# EAGLE schematic working (EAGLE 9.5.2)
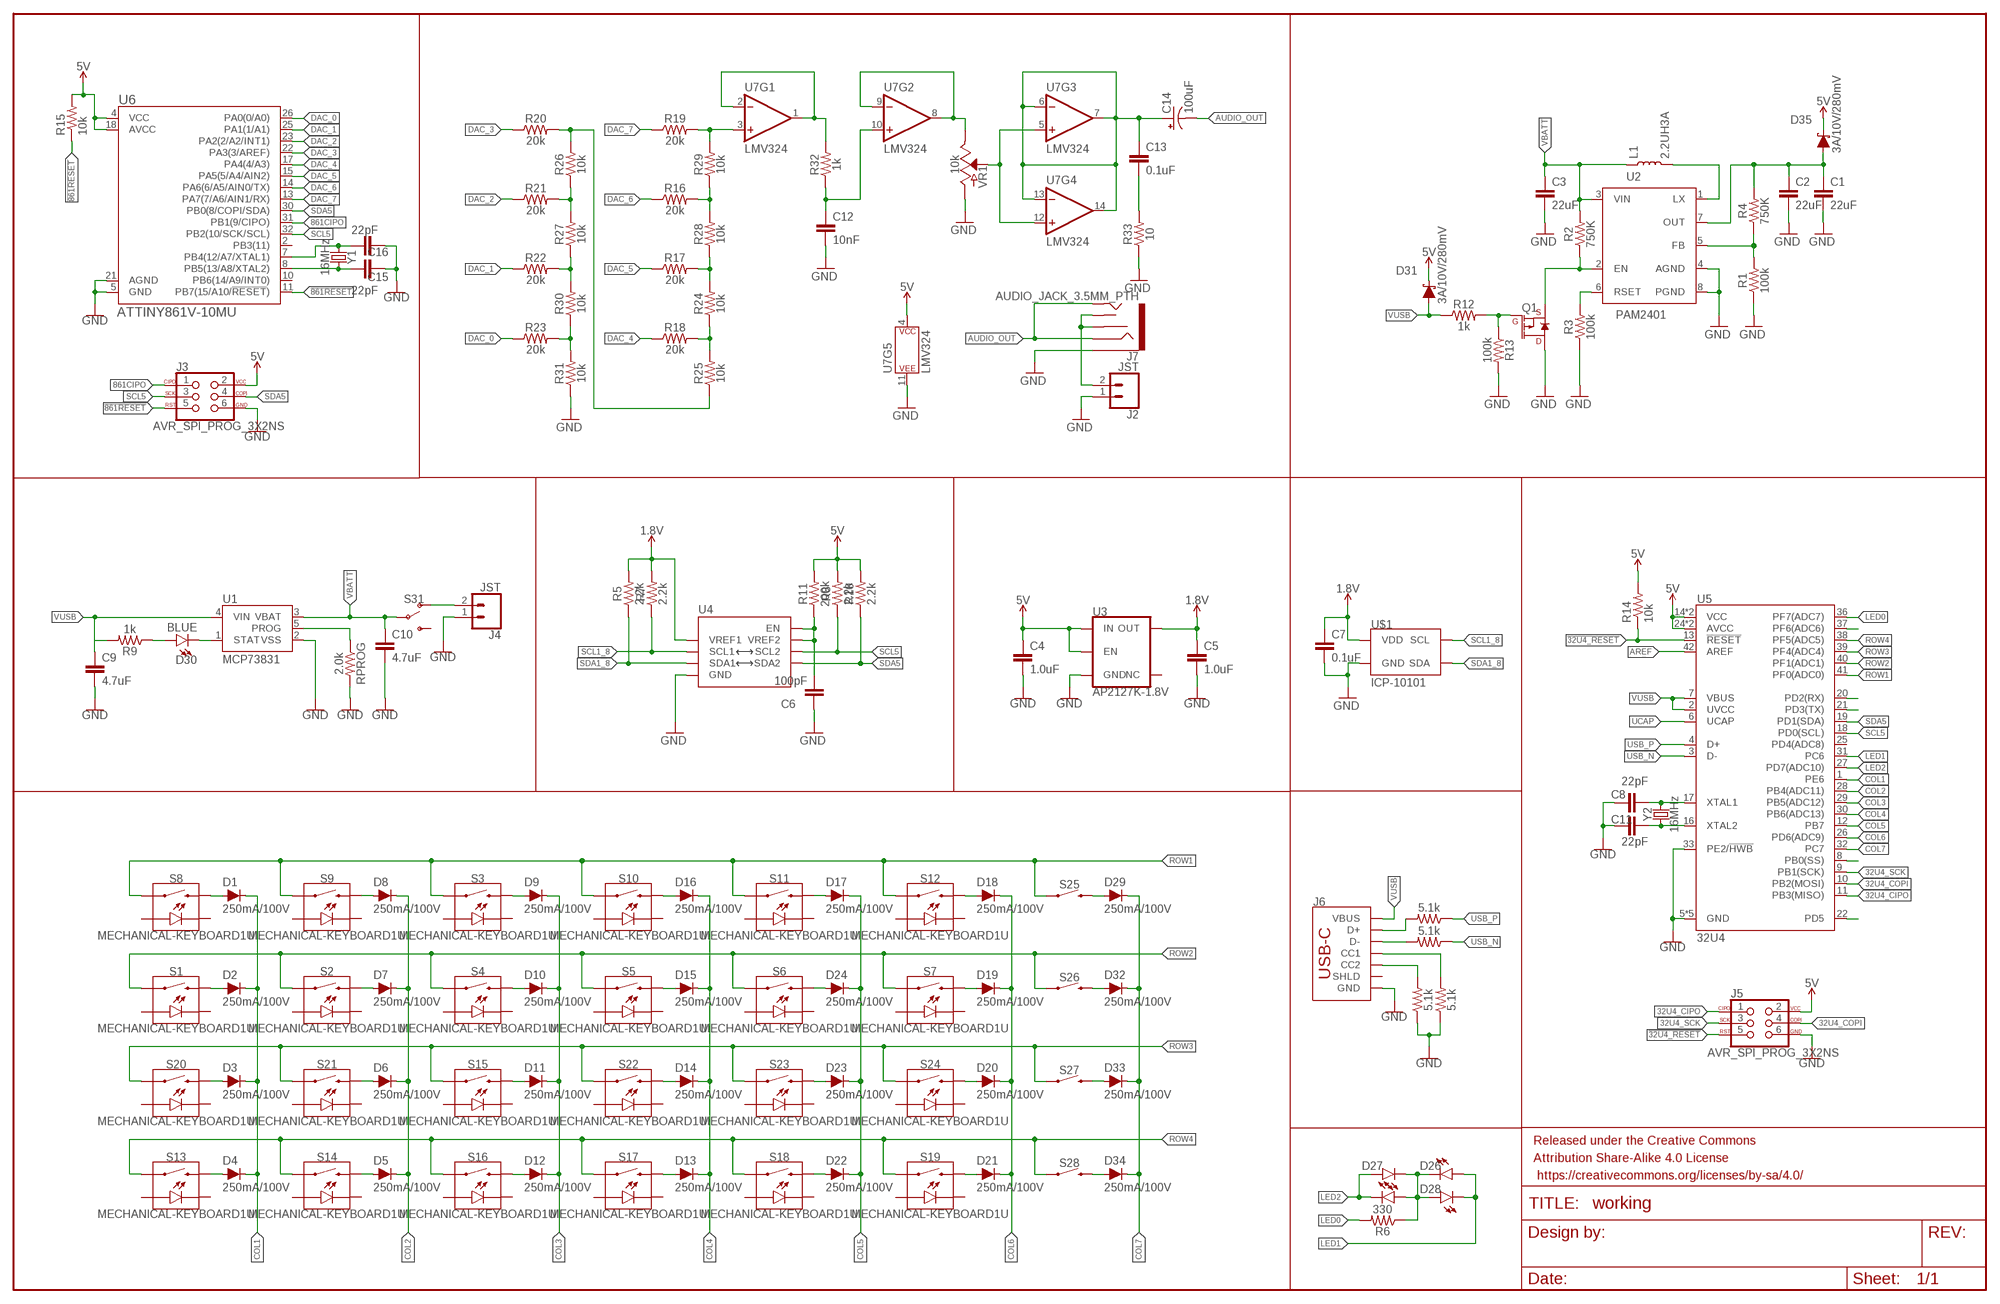
[diagram p0: schematic, sheet 1]

## Parts
C1  22uF  22UF-0805-6.3V-20%  [0805]
C2  22uF  22UF-0805-6.3V-20%  [0805]
C3  22uF  22UF-0805-6.3V-20%  [0805]
C4  1.0uF  1.0UF-0603-16V-10%  [0603]
C5  1.0uF  1.0UF-0603-16V-10%  [0603]
C6  100pF  100PF-0603-50V-5%  [0603]
C7  0.1uF  0.1UF-0603-25V-(+80/-20%)  [0603]
C8  22pF  22PF-0603-50V-5%  [0603]
C9  4.7uF  4.7UF-0603-35V-(20%)  [0603]
C10  4.7uF  4.7UF-0603-35V-(20%)  [0603]
C11  22pF  22PF-0603-50V-5%  [0603]
C12  10nF  10NF-0603-50V-10%  [0603]
C13  0.1uF  0.1UF-0603-25V-(+80/-20%)  [0603]
C14  100uF  100UF-POLAR-25V-20%(ELEC)  [PANASONIC_D]
C15  22pF  22PF-0603-50V-5%  [0603]
C16  22pF  22PF-0603-50V-5%  [0603]
D1  250mA/100V  DIODE-BAS16J  [SOD-323@1]
D2  250mA/100V  DIODE-BAS16J  [SOD-323@1]
D3  250mA/100V  DIODE-BAS16J  [SOD-323@1]
D4  250mA/100V  DIODE-BAS16J  [SOD-323@1]
D5  250mA/100V  DIODE-BAS16J  [SOD-323@1]
D6  250mA/100V  DIODE-BAS16J  [SOD-323@1]
D7  250mA/100V  DIODE-BAS16J  [SOD-323@1]
D8  250mA/100V  DIODE-BAS16J  [SOD-323@1]
D9  250mA/100V  DIODE-BAS16J  [SOD-323@1]
D10  250mA/100V  DIODE-BAS16J  [SOD-323@1]
D11  250mA/100V  DIODE-BAS16J  [SOD-323@1]
D12  250mA/100V  DIODE-BAS16J  [SOD-323@1]
D13  250mA/100V  DIODE-BAS16J  [SOD-323@1]
D14  250mA/100V  DIODE-BAS16J  [SOD-323@1]
D15  250mA/100V  DIODE-BAS16J  [SOD-323@1]
D16  250mA/100V  DIODE-BAS16J  [SOD-323@1]
D17  250mA/100V  DIODE-BAS16J  [SOD-323@1]
D18  250mA/100V  DIODE-BAS16J  [SOD-323@1]
D19  250mA/100V  DIODE-BAS16J  [SOD-323@1]
D20  250mA/100V  DIODE-BAS16J  [SOD-323@1]
D21  250mA/100V  DIODE-BAS16J  [SOD-323@1]
D22  250mA/100V  DIODE-BAS16J  [SOD-323@1]
D23  250mA/100V  DIODE-BAS16J  [SOD-323@1]
D24  250mA/100V  DIODE-BAS16J  [SOD-323@1]
D25  RED  LED-RED0603  [LED-0603@1]
D26  RED  LED-RED0603  [LED-0603@1]
D27  RED  LED-RED0603  [LED-0603@1]
D28  RED  LED-RED0603  [LED-0603@1]
D29  250mA/100V  DIODE-BAS16J  [SOD-323@1]
D30  BLUE  LED-BLUE0603  [LED-0603@1]
D31  3A/10V/280mV  DIODE-SCHOTTKY-BAT60A  [SOD-323]
D32  250mA/100V  DIODE-BAS16J  [SOD-323@1]
D33  250mA/100V  DIODE-BAS16J  [SOD-323@1]
D34  250mA/100V  DIODE-BAS16J  [SOD-323@1]
D35  3A/10V/280mV  DIODE-SCHOTTKY-BAT60A  [SOD-323]
FRAME1  FRAME-LEDGER  [CREATIVE_COMMONS]
J2  JST  CONN_02-JST-2MM-SMT  [JST-2-SMD]
J3  AVR_SPI_PROG_3X2NS  [2X3-NS]
J4  JST  CONN_02-JST-2MM-SMT  [JST-2-SMD]
J5  AVR_SPI_PROG_3X2NS  [2X3-NS]
J6  USB_C_2-LAYER_PADS  [USB-C-16P-2LAYER-PADS]
J7  AUDIO_JACK_3.5MM_PTH  [AUDIO-JACK]
L1  2.2UH3A  INDUCTOR-IFSC1515AHER2R2M01  [INDUCTOR_4X4MM]
Q1  100mA/20V/3.8Ω  MOSFET_PCH-RE1C001ZPTL  [SOT-416FL]
R1  100k  100KOHM-0603-1/10W-1%  [0603]
R2  750K  750KOHM-0603-1/10W-1%  [0603]
R3  100k  100KOHM-0603-1/10W-1%  [0603]
R4  750K  750KOHM-0603-1/10W-1%  [0603]
R5  2.2k  2.2KOHM-0603-1/10W-1%  [0603]
R6  330  330OHM-0603-1/10W-1%  [0603]
R7  2.2k  2.2KOHM-0603-1/10W-1%  [0603]
R8  2.2k  2.2KOHM-0603-1/10W-1%  [0603]
R9  1k  1KOHM-0603-1/10W-1%  [0603]
R10  2.2k  2.2KOHM-0603-1/10W-1%  [0603]
R11  200k  200KOHM-0603-1/10W-1%  [0603]
R12  1k  1KOHM-0603-1/10W-1%  [0603]
R13  100k  100KOHM-0603-1/10W-1%  [0603]
R14  10k  10KOHM-0603-1/10W-1%  [0603]
R15  10k  10KOHM-0603-1/10W-1%  [0603]
R16  20k  20KOHM-0603-1/10W-1%  [0603]
R17  20k  20KOHM-0603-1/10W-1%  [0603]
R18  20k  20KOHM-0603-1/10W-1%  [0603]
R19  20k  20KOHM-0603-1/10W-1%  [0603]
R20  20k  20KOHM-0603-1/10W-1%  [0603]
R21  20k  20KOHM-0603-1/10W-1%  [0603]
R22  20k  20KOHM-0603-1/10W-1%  [0603]
R23  20k  20KOHM-0603-1/10W-1%  [0603]
R24  10k  10KOHM-0603-1/10W-1%  [0603]
R25  10k  10KOHM-0603-1/10W-1%  [0603]
R26  10k  10KOHM-0603-1/10W-1%  [0603]
R27  10k  10KOHM-0603-1/10W-1%  [0603]
R28  10k  10KOHM-0603-1/10W-1%  [0603]
R29  10k  10KOHM-0603-1/10W-1%  [0603]
R30  10k  10KOHM-0603-1/10W-1%  [0603]
R31  10k  10KOHM-0603-1/10W-1%  [0603]
R32  1k  1KOHM-0603-1/10W-1%  [0603]
R33  10  10OHM-0603-1/10W-1%  [0603]
R34  5.1k  5.1KOHM5.1KOHM-0603-1/10W-1%  [0603]
R35  5.1k  5.1KOHM5.1KOHM-0603-1/10W-1%  [0603]
R36  5.1k  5.1KOHM5.1KOHM-0603-1/10W-1%  [0603]
R37  5.1k  5.1KOHM5.1KOHM-0603-1/10W-1%  [0603]
RPROG  2.0k  2.0KOHM-0603-1/10W-5%  [0603]
S1  MECHANICAL-KEYBOARD1U  [CHERRY-MX-LED-1U]
S2  MECHANICAL-KEYBOARD1U  [CHERRY-MX-LED-1U]
S3  MECHANICAL-KEYBOARD1U  [CHERRY-MX-LED-1U]
S4  MECHANICAL-KEYBOARD1U  [CHERRY-MX-LED-1U]
S5  MECHANICAL-KEYBOARD1U  [CHERRY-MX-LED-1U]
S6  MECHANICAL-KEYBOARD1U  [CHERRY-MX-LED-1U]
S7  MECHANICAL-KEYBOARD1U  [CHERRY-MX-LED-1U]
S8  MECHANICAL-KEYBOARD1U  [CHERRY-MX-LED-1U]
S9  MECHANICAL-KEYBOARD1U  [CHERRY-MX-LED-1U]
S10  MECHANICAL-KEYBOARD1U  [CHERRY-MX-LED-1U]
S11  MECHANICAL-KEYBOARD1U  [CHERRY-MX-LED-1U]
S12  MECHANICAL-KEYBOARD1U  [CHERRY-MX-LED-1U]
S13  MECHANICAL-KEYBOARD1U  [CHERRY-MX-LED-1U]
S14  MECHANICAL-KEYBOARD1U  [CHERRY-MX-LED-1U]
S15  MECHANICAL-KEYBOARD1U  [CHERRY-MX-LED-1U]
S16  MECHANICAL-KEYBOARD1U  [CHERRY-MX-LED-1U]
S17  MECHANICAL-KEYBOARD1U  [CHERRY-MX-LED-1U]
S18  MECHANICAL-KEYBOARD1U  [CHERRY-MX-LED-1U]
S19  MECHANICAL-KEYBOARD1U  [CHERRY-MX-LED-1U]
S20  MECHANICAL-KEYBOARD1U  [CHERRY-MX-LED-1U]
S21  MECHANICAL-KEYBOARD1U  [CHERRY-MX-LED-1U]
S22  MECHANICAL-KEYBOARD1U  [CHERRY-MX-LED-1U]
S23  MECHANICAL-KEYBOARD1U  [CHERRY-MX-LED-1U]
S24  MECHANICAL-KEYBOARD1U  [CHERRY-MX-LED-1U]
S25  MOMENTARY-SWITCH-SPST-SMD-5.2MM-TALL  [TACTILE_SWITCH_SMD_5.2MM]
S26  MOMENTARY-SWITCH-SPST-SMD-5.2MM-TALL  [TACTILE_SWITCH_SMD_5.2MM]
S27  MOMENTARY-SWITCH-SPST-SMD-5.2MM-TALL  [TACTILE_SWITCH_SMD_5.2MM]
S28  MOMENTARY-SWITCH-SPST-SMD-5.2MM-TALL  [TACTILE_SWITCH_SMD_5.2MM]
S31  SWITCH-SPDT-SMD-RIGHT-ANGLE  [SWITCH_SPST_SMD_A]
U1  MCP73831  [SOT23-5]
U2  PAM2401  [MSOP8]
U3  AP2127K-1.8V  V_REG_AP2127K-1.8V  [SOT23-5]
U4  PCA9306VSSOP_8PIN  [VSSOP_8PIN]
U5  32U4  ATMEGA32U41:1-LESS_PASTE  [QFN-44-NOPAD_1:1-LESS_PASTE]
U6  ATTINY861V-10MU  [32M1-A_ATM]
U7  LMV324  [SO14]
U$1  ICP-10101  [ICP-10101]
VR1  10k  POTENTIOMETER_SLIDE-20MM-1/10W-20%  [SLIDER-SMALL]
Y1  16MHz  CRYSTAL-16MHZSMD-2X1.6  [CRYSTAL-SMD-2.0X1.6MM]
Y2  16MHz  CRYSTAL-16MHZSMD-2X1.6  [CRYSTAL-SMD-2.0X1.6MM]

## Nets
1.8V: C5.1 C7.1 R5.2 R7.2 U3.5(OUT) U4.P2(VREF1) U$1.5(VDD) U$1.6(VDD) U$1.10(VDD)
5V: C4.1 D31.C D35.C J3.2 J5.2 R8.2 R10.2 R11.2 R14.2 R15.2 U3.1(IN) U3.3(EN) U5.14(VCC) U5.24(AVCC) U5.34(VCC) U5.44(AVCC) U6.4(VCC) U6.18(AVCC) U7.4(P$V+)
32U4_CIPO: J5.1 U5.11(PB3(MISO))
32U4_COPI: J5.4 U5.10(PB2(MOSI))
32U4_SCK: J5.3 U5.9(PB1(SCK))
861CIPO: J3.1 U6.31(PB1(9/CIPO))
!32U4_RESET: J5.5 R14.1 U5.13(!RESET)
!861RESET: J3.5 R15.1 U6.11(PB7(15/A10/!RESET!))
AREF: U5.42(AREF)
AUDIO_OUT: C14.- J7.RING J7.TIP
COL1: D1.C D2.C D3.C D4.C U5.1(PE6)
COL2: D5.C D6.C D7.C D8.C U5.28(PB4(ADC11))
COL3: D9.C D10.C D11.C D12.C U5.29(PB5(ADC12))
COL4: D13.C D14.C D15.C D16.C U5.30(PB6(ADC13))
COL5: D17.C D22.C D23.C D24.C U5.12(PB7)
COL6: D18.C D19.C D20.C D21.C U5.26(PD6(ADC9))
COL7: D29.C D32.C D33.C D34.C U5.32(PC7)
DAC_0: R23.1 U6.26(PA0(0/A0))
DAC_1: R22.1 U6.25(PA1(1/A1))
DAC_2: R21.1 U6.23(PA2(2/A2/INT1))
DAC_3: R20.1 U6.22(PA3(3/AREF))
DAC_4: R18.1 U6.17(PA4(4/A3))
DAC_5: R17.1 U6.15(PA5(5/A4/AIN2))
DAC_6: R16.1 U6.14(PA6(6/A5/AIN0/TX))
DAC_7: R19.1 U6.13(PA7(7/A6/AIN1/RX))
DAC_OUT: R19.2 R29.2 U7.3(+IN)
EN: Q1.2(S) R2.1 U2.2(EN)
GND: C1.2 C2.2 C3.2 C4.2 C5.2 C6.1 C7.2 C8.2 C9.2 C10.2 C11.2 C12.2 C15.2 C16.2 J2.1 J3.6 J4.1 J5.6 J6.GND J6.GND2(GND) J7.SLEEVE Q1.3(D) R1.1 R3.1 R13.2 R31.1 R33.1 R34.1 R35.1 RPROG.2 U1.2(VSS) U2.4(AGND) U2.8(PGND) U3.2(GND) U4.P1(GND) U5.5(GND) U5.15(GND) U5.23(GND) U5.33(PE2/!HWB) U5.35(GND) U5.43(GND) U6.5(GND) U6.21(AGND) U7.11(P$V-) U$1.3(GND) U$1.8(GND) U$1.9(GND) VR1.BOTTOM(A)
LED0: R6.2 U5.36(PF7(ADC7))
LED1: D26.A D28.C U5.31(PC6)
LED2: D25.A D27.C U5.27(PD7(ADC10))
N$1: RPROG.1 U1.5(PROG)
N$2: D30.C U1.1(STAT)
N$3: J4.2 S31.1(O)
N$4: D30.A R9.1
N$5: D1.A S8.S2
N$6: D2.A S1.S2
N$7: D3.A S20.S2
N$8: D4.A S13.S2
N$9: D5.A S14.S2
N$10: D6.A S21.S2
N$11: D7.A S2.S2
N$12: D8.A S9.S2
N$13: D9.A S3.S2
N$14: D10.A S4.S2
N$15: D11.A S15.S2
N$16: D12.A S16.S2
N$17: D13.A S17.S2
N$18: D14.A S22.S2
N$19: D15.A S5.S2
N$20: D16.A S10.S2
N$21: D17.A S11.S2
N$22: D24.A S6.S2
N$23: D23.A S23.S2
N$24: D22.A S18.S2
N$25: D21.A S19.S2
N$26: D20.A S24.S2
N$27: D19.A S7.S2
N$28: D18.A S12.S2
N$29: R1.2 R4.1 U2.5(FB)
N$30: L1.P$2 U2.1(LX)
N$31: R3.2 U2.6(RSET)
N$32: D29.A S25.3
N$33: D32.A S26.3
N$34: Q1.1(G) R12.2 R13.1
N$35: D33.A S27.3
N$36: D34.A S28.3
N$37: D25.C D26.C D27.A D28.A R6.1
N$38: U5.8(PB0(SS))
N$40: C6.2 R11.1 U4.P7(VREF2) U4.P8(EN)
N$42: C1.1 C2.1 D35.A R4.2 U2.7(OUT)
N$43: C11.1 U5.16(XTAL2) Y2.1
N$44: C8.1 U5.17(XTAL1) Y2.3
N$45: U7.8(OUT) U7.9(-IN) VR1.TOP(E)
N$46: R16.2 R28.2 R29.1
N$47: R17.2 R24.2 R28.1
N$48: R18.2 R24.1 R25.2
N$49: R20.2 R25.1 R26.2
N$50: R21.2 R26.1 R27.2
N$51: R22.2 R27.1 R30.2
N$52: R23.2 R30.1 R31.2
N$53: R32.2 U7.1(OUT) U7.2(-IN)
N$54: C12.1 R32.1 U7.10(+IN)
N$55: U7.5(+IN) U7.12(+IN) VR1.WIPER(S)
N$56: C13.1 C14.+ U7.6(-IN) U7.7(OUT) U7.13(-IN) U7.14(OUT)
N$57: C13.2 R33.2
N$58: J6.A5(CC1) R35.2
N$59: J6.B5(CC2) R34.2
N$60: J6.A6(D+) J6.B6(D+) R36.2
N$61: J6.A7(D-) J6.B7(D-) R37.2
N$62: C16.1 U6.7(PB4(12/A7/XTAL1)) Y1.1
N$63: C15.1 U6.8(PB5(13/A8/XTAL2)) Y1.3
N$76: J2.2 J7.RSH J7.TSH
N$77: U5.37(PF6(ADC6))
N$79: U5.20(PD2(RX))
N$80: U5.21(PD3(TX))
ROW1: S3.S1 S8.S1 S9.S1 S10.S1 S11.S1 S12.S1 S25.1 U5.41(PF0(ADC0))
ROW2: S1.S1 S2.S1 S4.S1 S5.S1 S6.S1 S7.S1 S26.1 U5.40(PF1(ADC1))
ROW3: S15.S1 S20.S1 S21.S1 S22.S1 S23.S1 S24.S1 S27.1 U5.39(PF4(ADC4))
ROW4: S13.S1 S14.S1 S16.S1 S17.S1 S18.S1 S19.S1 S28.1 U5.38(PF5(ADC5))
SCL1_8: R7.1 U4.P3(SCL1) U$1.2(SCL)
SCL5: J3.3 R8.1 U4.P6(SCL2) U5.18(PD0(SCL)) U6.32(PB2(10/SCK/SCL))
SDA1_8: R5.1 U4.P4(SDA1) U$1.4(SDA)
SDA5: J3.4 R10.1 U4.P5(SDA2) U5.19(PD1(SDA)) U6.30(PB0(8/COPI/SDA))
TXLED: U5.22(PD5)
UCAP: U5.6(UCAP)
USB_N: R37.1 U5.3(D-)
USB_P: R36.1 U5.4(D+)
VBATT: C3.1 C10.1 L1.P$1 R2.2 S31.2(P) U1.3(VBAT) U2.3(VIN)
VUSB: C9.1 D31.A J6.VBUS1(VBUS) J6.VBUS2(VBUS) R9.2 R12.1 U1.4(VIN) U5.2(UVCC) U5.7(VBUS)
Unconnected: J6.SHLD1(SHLD) J6.SHLD2(SHLD) J6.SHLD3(SHLD) J6.SHLD4(SHLD) S1.A S1.K(C) S2.A S2.K(C) S3.A S3.K(C) S4.A S4.K(C) S5.A S5.K(C) S6.A S6.K(C) S7.A S7.K(C) S8.A S8.K(C) S9.A S9.K(C) S10.A S10.K(C) S11.A S11.K(C) S12.A S12.K(C) S13.A S13.K(C) S14.A S14.K(C) S15.A S15.K(C) S16.A S16.K(C) S17.A S17.K(C) S18.A S18.K(C) S19.A S19.K(C) S20.A S20.K(C) S21.A S21.K(C) S22.A S22.K(C) S23.A S23.K(C) S24.A S24.K(C) S31.3(S) U3.4(NC) U5.25(PD4(ADC8)) U6.2(PB3(11)) U6.10(PB6(14/A9/INT0))

## Library data of the parts
C1-C3 = SparkFun-Capacitors:22UF: 22µF ceramic capacitors A capacitor is a passive two-terminal electrical component used to store electrical energy temporarily in an electric field.; PROD_ID: CAP-08402
C4 C5 = SparkFun-Capacitors:1.0UF: 1µF ceramic capacitors A capacitor is a passive two-terminal electrical component used to store electrical energy temporarily in an electric field.; PROD_ID: CAP-00868
C6 = SparkFun-Capacitors:100PF: 100pF/0.1nF ceramic capacitors A capacitor is a passive two-terminal electrical component used to store electrical energy temporarily in an electric field.; PROD_ID: CAP-07883
C7 C13 = SparkFun-Capacitors:0.1UF: 0.1µF ceramic capacitors A capacitor is a passive two-terminal electrical component used to store electrical energy temporarily in an electric field.; PROD_ID: CAP-00810
C8 C11 C15 C16 = SparkFun-Capacitors:22PF: 22pF ceramic capacitors A capacitor is a passive two-terminal electrical component used to store electrical energy temporarily in an electric field.; PROD_ID: CAP-07876
C9 C10 = SparkFun-Capacitors:4.7UF: 4.7µF ceramic capacitors A capacitor is a passive two-terminal electrical component used to store electrical energy temporarily in an electric field.; PROD_ID: CAP-14106
C12 = SparkFun-Capacitors:10NF: 0.01uF/10nF/10,000pF ceramic capacitors A capacitor is a passive two-terminal electrical component used to store electrical energy temporarily in an electric field. CAP-09321; PROD_ID: CAP-00867
C14 = SparkFun-Capacitors:100UF-POLAR: 100µF polarized capacitors A capacitor is a passive two-terminal electrical component used to store electrical energy temporarily in an electric field.; PROD_ID: CAP-12547
D1-D24 D29 D32-D34 = SparkFun-DiscreteSemi:DIODE: Diode These are standard reverse protection diodes and small signal diodes. SparkFun Products: SparkFun SparkPunk Sound Kit <https://www.sparkfun.com/products/11177> SparkFun ESP8266 Thing <https://www.sparkfun.com/products/13231>; PROD_ID: DIO-09646
D25-D28 = SparkFun-LED:LED-RED: Red SMD LED Used in manufacturing of most products at SparkFun Packages: 0603 - SMD 0603 package [Product Link] <http://docs.avagotech.com/docs/AV02-0551EN> 0603 SMART - SMD 0603 SMART package ( more efficient and expensive)[Product Link] <http://www.osram-os.com/Graphics/XPic2/00077099_0.pdf> 1206 - SMD1206 package [Product Link] <https://www.sparkfun.com/datasheets/DevTools/LilyPad/Q150OVS4.pdff> SparkFun Products: Pro Mini 328 -5V <https://www.sparkfun.com/products/821> RedBoard <https://www.sparkfun.com/products/12757> IOIO-OTG <https://www.sparkfun.com/products/13613>; PROD_ID: DIO-00819
D30 = SparkFun-LED:LED-BLUE: Blue SMD LED Used in manufacturing of various products at SparkFun Packages: 0603 - SMD 0603 package [Product Link] <http://www.digikey.com/product-detail/en/SMLE12BC7TT86/511-1589-2-ND/1641808> 1206 - SMD1206 package [Product Link] <http://www.digikey.com/product-detail/en/lite-on-inc/LTST-C150TBKT/160-1643-1-ND/573584> SparkFun Products: ESP8266 Thing-Dev Board <https://www.sparkfun.com/products/13711> RedBoard <https://www.sparkfun.com/products/12757>; PROD_ID: DIO-08575
D31 D35 = SparkFun-DiscreteSemi:DIODE-SCHOTTKY: Schottky diode A Schottky diode is a semiconductor diode which has a low forward voltage drop and a very fast switching action.; PROD_ID: DIO-14072
FRAME1 = SparkFun-Aesthetics:FRAME-LEDGER: Schematic Frame - Ledger Standard 11x14 US Ledger frame
J2 J4 = SparkFun-Connectors:CONN_02: Multi connection point. Often used as Generic Header-pin footprint for 0.1 inch spaced/style header connections On any of the 0.1 inch spaced packages, you can populate with these: Break Away Headers - Straight <https://www.sparkfun.com/products/116> (PRT-00116) Break Away Male Headers - Right Angle <https://www.sparkfun.com/products/553> (PRT-00553) Female Headers <https://www.sparkfun.com/products/115> (PRT-00115) Break Away Headers - Machine Pin <https://www.sparkfun.com/products/117> (PRT-00117) Break Away Female Headers - Swiss Machine Pin <https://www.sparkfun.com/products/743> (PRT-00743) For SCREWTERMINALS and SPRING TERMINALS visit here: Screw Terimnals on SparkFun.com <https://www.sparkfun.com/search/results?term=Screw+Terminals> (5mm/3.5mm/2.54mm spacing) This device is also useful as a general connection point to wire up your design to another part of your project. Our various solder wires solder well into these plated through hole pads. Hook-Up Wire - Assortment (Stranded, 22 AWG) <https://www.sparkfun.com/products/11375> (PRT-11375) Hook-Up Wire - Assortment (Solid Core, 22 AWG) <https://www.sparkfun.com/products/11367> (PRT-11367) View the entire wire category on our website here <https://www.sparkfun.com/categories/141> Special notes: Molex polarized connector foot print use with: PRT-08233 with associated crimp pins and housings. 2.54_SCREWTERM for use with PRT-10571. 3.5mm Screw Terminal footprints for PRT-08084 5mm Screw Terminal footprints for use with PRT-08432; PROD_ID: CONN-11443
J3 J5 = SparkFun-Connectors:AVR_SPI_PROG_3X2: AVR ISP 6 Pin This is the reduced ISP connector for AVR programming. Common on Arduino. This footprint will take up less PCB space and can be used with a 10-pin to 6-pin adapter such as SKU: BOB-08508 **Special note about "TEST_POINT" package. The stop mask is on the top side, so if you want your programming test points to be on the bottom of your board, make sure to place this package on the bottom side of the board. This also ensure that the orientation to program from the bottom side will be correct. SparkFun Products: SparkFun ISP Pogo Adapter <https://www.sparkfun.com/products/11591> - NS Tiny AVR Programmer <https://www.sparkfun.com/products/11801> -PTH
J6 = SparkFun-Connectors:USB_C: USB Type C 16Pin Connector Super Speed pins not available on the 16-pin purely SMD connector so this part is best for USB 2.0 implementations. D1 and D2 are tied together enabling D+/- no matter which way the cable is plugged into the connector. The two channel configuration pins (CC1/2) are exposed. These are normally connected to ground via 5.1k resistors but can be reconfigured for high current/high power applications. **4-LAYER BOARD WARNING!!** If designing 4-layer board, make sure to select the variant _4-LAYER-ISOLATED. The linked footprint (USB-C-16-4LAYER-ISOLATED) includes some very necessary cutout polygons in the inner layers (2 and 15). This prevents the PTH mounting shield legs on the USB connector from electrically connecting any other polygons on the inner layers (usually VCC and GND).; PROD_ID: CONN-14122
J7 = SparkFun-Connectors:AUDIO_JACK_3.5MM: Audio Jack 3.5mm variants of PTH and SMT stereo audio jack with bypass switches. SparkFun Products: SparkFun SparkPunk Sound Kit <[https://www.sparkfun.com/products/11177]> - PTH MP3 Trigger <https://www.sparkfun.com/products/13720> -3.5mm SMD SparkFun PicoBoard <https://www.sparkfun.com/products/11888>- 2.5mm SMD; PROD_ID: CONN-08774; SF_ID: PRT-08032
L1 = SparkFun-Coils:INDUCTOR: Inductors Resist changes in electrical current. Basically a coil of wire. SparkFun Products: SparkFun Load Cell Amplifier - HX711 <https://www.sparkfun.com/products/13879> IOIO-OTG - V2.2 <https://www.sparkfun.com/products/13613>; PROD_ID: NDUC-13770
Q1 = SparkFun-DiscreteSemi:MOSFET_PCH: P-channel MOSFETs Voltage controlled devices that allow control of high current outputs. SparkFun Products: SparkFun ESP32 Thing <https://www.sparkfun.com/products/13907> SparkFun ESP8266 Thing <https://www.sparkfun.com/products/13231> SparkFun Pi Servo HAT V2 <https://www.sparkfun.com/products/15316> DMG2305UX-7 (20V/4.2A/SOT23-3); PROD_ID: TRANS-15421
R1 R3 R13 = SparkFun-Resistors:100KOHM: 100kΩ resistor A resistor is a passive two-terminal electrical component that implements electrical resistance as a circuit element. Resistors act to reduce current flow, and, at the same time, act to lower voltage levels within circuits. - Wikipedia; PROD_ID: RES-07828
R2 R4 = SparkFun-Resistors:750KOHM: 750Ω resistor A resistor is a passive two-terminal electrical component that implements electrical resistance as a circuit element. Resistors act to reduce current flow, and, at the same time, act to lower voltage levels within circuits. - Wikipedia; PROD_ID: RES-13768
R5 R7 R8 R10 = SparkFun-Resistors:2.2KOHM: 2.2kΩ resistor A resistor is a passive two-terminal electrical component that implements electrical resistance as a circuit element. Resistors act to reduce current flow, and, at the same time, act to lower voltage levels within circuits. - Wikipedia; PROD_ID: RES-08272
R6 = SparkFun-Resistors:330OHM: 330Ω resistor A resistor is a passive two-terminal electrical component that implements electrical resistance as a circuit element. Resistors act to reduce current flow, and, at the same time, act to lower voltage levels within circuits. - Wikipedia; PROD_ID: RES-00818
R9 R12 R32 = SparkFun-Resistors:1KOHM: 1kΩ resistor A resistor is a passive two-terminal electrical component that implements electrical resistance as a circuit element. Resistors act to reduce current flow, and, at the same time, act to lower voltage levels within circuits. - Wikipedia; PROD_ID: RES-07856
R11 = SparkFun-Resistors:200KOHM: 200kΩ resistor A resistor is a passive two-terminal electrical component that implements electrical resistance as a circuit element. Resistors act to reduce current flow, and, at the same time, act to lower voltage levels within circuits. - Wikipedia; PROD_ID: RES-09385
R14 R15 R24-R31 = SparkFun-Resistors:10KOHM: 10kΩ resistor A resistor is a passive two-terminal electrical component that implements electrical resistance as a circuit element. Resistors act to reduce current flow, and, at the same time, act to lower voltage levels within circuits. - Wikipedia; PROD_ID: RES-00824
R16-R23 = SparkFun-Resistors:20KOHM: 20kΩ resistor A resistor is a passive two-terminal electrical component that implements electrical resistance as a circuit element. Resistors act to reduce current flow, and, at the same time, act to lower voltage levels within circuits. - Wikipedia; PROD_ID: RES-09383
R33 = SparkFun-Resistors:10OHM: 10Ω resistor A resistor is a passive two-terminal electrical component that implements electrical resistance as a circuit element. Resistors act to reduce current flow, and, at the same time, act to lower voltage levels within circuits. - Wikipedia; PROD_ID: RES-12581
R34-R37 = SparkFun-Resistors:5.1KOHM; PROD_ID: RES-12083
RPROG = SparkFun-Resistors:2.0KOHM: 2kΩ resistor A resistor is a passive two-terminal electrical component that implements electrical resistance as a circuit element. Resistors act to reduce current flow, and, at the same time, act to lower voltage levels within circuits. - Wikipedia; PROD_ID: RES-08296
S1-S24 = SparkFun-Switches:MECHANICAL-KEYBOARD: Mechanical Keyboard Spacings for Cherry-MX Cherry-MX w/ LED switch footprints. Each package variant contains a bounding box on the tDocu layer for proper key spacing and a dimensional drawing on the Reference layer to be exported for laser cut mounting plates. Footprints are off-center so that the origin lies on the lower left corner of the key-spacing. This allows for most common layouts to be easily acheived on a grid spacing of 0.1875" Variants 1U through 1.75U in .25U steps Centered switch cutout in SwitchPlate layer with no stabilizers 2U through 2.75U in .25U steps Centered switch cutout in SwitchPlate layer with Cherry+Costar stabilizer holes 6.25U Common spacebar size Centered switch cutout in SwitchPlate layer with Cherry+Costar stabilizer holes "Big Ass" Enter ANSI 104 "Big Ass" Enter Key layout ISO Enter ISO style Enter Key layout
S25-S28 = SparkFun-Switches:MOMENTARY-SWITCH-SPST: Momentary Switch (Pushbutton) - SPST Normally-open (NO) SPST momentary switches (buttons, pushbuttons). Variants PTH-12MM - 12mm square, through-hole Momentary Pushbutton Switch - 12mm Square <https://www.sparkfun.com/products/9190> (COM-09190) PTH-6.0MM, PTH-6.0MM-KIT - 6.0mm square, through-hole Mini Pushbutton Switch <https://www.sparkfun.com/products/97> (COM-00097) KIT package intended for soldering kit's - only one side of pads' copper is exposed. PTH-RIGHT-ANGLE-KIT - Right-angle, through-hole Right Angle Tactile Button <https://www.sparkfun.com/products/10791> - Used on SparkFun BigTime Watch Kit <https://www.sparkfun.com/products/11734> SMD-12MM - 12mm square, surface-mount Tactile Button - SMD (12mm) <https://www.sparkfun.com/products/12993> (COM-12993) Used on SparkFun PicoBoard <https://www.sparkfun.com/products/11888> SMD-4.5MM - 4.5mm Square Trackball Switch Used on SparkFun Blackberry Trackballer Breakout <https://www.sparkfun.com/products/13169> SMD-4.6MMX2.8MM - 4.60mm x 2.80mm, surface mount Used on SparkFun SAMD21 Mini Breakout <https://www.sparkfun.com/products/13664> SMD-5.2MM, SMD-5.2-REDUNDANT - 5.2mm square, surface-mount Mini Pushbutton Switch - SMD <https://www.sparkfun.com/products/8720> (COM-08720) Used on Arduino Pro Mini <https://www.sparkfun.com/products/11114> REDUNDANT package connects both switch circuits together SMD-6.0X3.5MM - 6.0 x 3.5mm, surface mount Momentary Reset Switch SMD <https://www.sparkfun.com/products/8229> (COM-08229) SMD-6.2MM-TALL - 6.2mm square, surface mount Tactile Button - SMD (6mm) <https://www.sparkfun.com/products/12992> Used on SparkFun Digital Sandbox <https://www.sparkfun.com/products/12651> SMD-RIGHT-ANGLE - Right-angle, surface mount Used on SparkFun Block for Intel® Edison - Arduino <https://www.sparkfun.com/products/13036>; PROD_ID: SWCH-14139
S31 = SparkFun-Switches:SWITCH-SPDT: Single Pole, Double Throw (SPDT) Switch Single-pole, double-throw (SPDT) switch. Variant Overview SMD-AYZ0202 Surface Mount DPDT Switch <https://www.sparkfun.com/products/597> (COM-00597) Used on e.g. LilyPad Arduino USB - ATmega32U4 Board <https://www.sparkfun.com/products/12049> PTH-11.6X4.0MM SPDT Mini Power Switch <https://www.sparkfun.com/products/102> (COM-00102) Used on e.g. SparkFun Simon Says - Through-Hole Soldering Kit <https://www.sparkfun.com/products/10547> (KIT-10547) PTH-11.6X4.0MM-KIT KIT version of SPDT Mini Power Switch - Simplifies soldering by removing tStop of switch pins - only one side can be soldered. PTH-11.6X4.0MM-LOCK LOCK version of SPDT Mini Power Switch - Offset pins hold switch in place for easier soldering. SMD-RIGHT-ANGLE Surface Mount Right Angle Switch <https://www.sparkfun.com/products/10860> (COM-10860) Used on e.g. SparkFun ESP8266 Thing <https://www.sparkfun.com/products/13231>; PROD_ID: SWCH-10651; SF_SKU: COM-10860
U1 = SparkFun-IC-Power:MCP73831: MCP73831T Li-Ion, Li-Pol Controller Miniature single cell, fully integrated Li-Ion, Li-polymer charge management controller Datasheet <http://ww1.microchip.com/downloads/en/DeviceDoc/20001984g.pdf> SparkFun Products: SparkFun ESP32 Thing <https://www.sparkfun.com/products/13907> SparkFun 9DoF Razor IMU M0 <https://www.sparkfun.com/products/14001>; PROD_ID: IC-09995
U2 = SparkFun-IC-Power:PAM2401: PAM2401 - Boost PMIC Specifications: Up to 1A output current 0.9V to 4.75V Input Range 2.5V to 5.0V Adjustable Output Voltage Datasheet <https://www.diodes.com/assets/Datasheets/PAM2401.pdf> (Diodes inc.); PROD_ID: IC-13769
U3 = SparkFun-IC-Power:V_REG_AP2127: AP2127 - 300mA CMOS LDO Regulator w/ Enable The AP2127 is CMOS process low dropout linear regulator with enable function, the regulator delivers a guaranteed 300mA (min.) continuous load current. Features Output Voltage Accuracy: ±1.5% Output Current: 300mA (Min.) Foldback Short Current Protection: 50mA Enable Function to Turn ON/OFF VOUT Low Dropout Voltage (3.3V): 250mV (Typ.) @IOUT=600mA Excellent Load Regulation: 0.2%/A (Typ.) Excellent Line Regulation: 0.02%/V (Typ.) Low Quiescent Current: 55μA (Typ.) Low Standby Current: 0.01μA (Typ.) Low Output Noise: 50μVRMS PSRR: 100Hz -65dB, 1kHz -65dB OTSD Protection Stable with 1.0μF Flexible Cap: Ceramic, Tantalum and Aluminum Electrolytic Operation Temperature Range: -40°C to 85°C ESD: MM 400V, HBM 4000V; PROD_ID: VREG-14239
U4 = SparkFun-IC-Comms:PCA9306: Bidirectional I2C level shifter Not compatible with all available part number pinout schemes- DOUBLE CHECK!!! Variants PCA9306DC and PSOP-8 are EOL. If your part has VREF as pin 1 then this is your variant. VSSOP_8PIN is not EOL. Datasheet <https://cdn.sparkfun.com/datasheets/BreakoutBoards/PCA9306DC.pdf> SparkFun Products SparkFun Inventor's Kit for RedBot <https://www.sparkfun.com/products/12649> (ROB-12649) SparkFun RedBot Basic Kit <https://www.sparkfun.com/products/13166> (ROB-13166) SparkFun Level Translator Breakout - PCA9306 <https://www.sparkfun.com/products/11955> (BOB-11955) SparkFun Block for Intel Edison - ADC <https://www.sparkfun.com/products/13770> (DEV-13770) SparkFun Block for Intel® Edison - Raspberry Pi B <https://www.sparkfun.com/products/13044> (DEV-13044) SparkFun RedBot Sensor - Accelerometer <https://www.sparkfun.com/products/12589> (SEN-12589); PROD_ID: IC-14450
U5 = SparkFun-IC-Microcontroller:ATMEGA32U4: Atmel MCU, 32KByte Atmel 44-pin 8-bit Microcontroller with 32KBytes of ISP Flash and USB Controller Datasheet <http://cdn.sparkfun.com/datasheets/Dev/Arduino/Boards/ATMega32U4.pdf> SparkFun Products LilyPad Arduino USB - ATmega32U4 Board <https://www.sparkfun.com/products/12049> (DEV-12049) Pro Micro - 5V/16MHz <https://www.sparkfun.com/products/12640> (DEV-12640) Pro Micro - 3.3V/8MHz <https://www.sparkfun.com/products/12587> (DEV-12587) Fio v3 - ATmega32U4 <https://www.sparkfun.com/products/11520> (DEV-11520) Qduino Mini <https://www.sparkfun.com/products/13614> (DEV-13614) Makey Makey - Standard Kit <https://www.sparkfun.com/products/11511> (WIG-11511) Makey Makey Deluxe Kit <https://www.sparkfun.com/products/11519> (WIG-11519); PROD_ID: IC-10828
U6 = Melodica:ATTINY861V-10MU; COPYRIGHT: Copyright (C) 2021 Ultra Librarian. All rights reserved.; DIGI-KEY_PART_NUMBER_1: ATTINY861V-10MU-ND; DIGI-KEY_PART_NUMBER_2: 2156-ATTINY861V-10MU-ND; MANUFACTURER_PART_NUMBER: ATTINY861V-10MU; MFR_NAME: Microchip
U7 = SparkFun-IC-Amplifiers:LMV324: IC LMV324 Quad Op Amp Jellybean quad op-amp Datasheet <http://cdn.sparkfun.com/datasheets/Sensors/Sound/LMV324.pdf> SparkFun Products SparkFun Sensor Kit <https://www.sparkfun.com/products/13754> (DEV-13754) SparkFun Inventor's Kit for Arduino 101 <https://www.sparkfun.com/products/13844> (KIT-13844) SparkFun Sound Detector <https://www.sparkfun.com/products/12642> (SEN-12642); PROD_ID: IC-08227
U$1 = Melodica:ICP-10101
VR1 = SparkFun-Resistors:POTENTIOMETER_SLIDE: Slide Potentiometer Slide-type potentiometers - pots that are adjusted by sliding a wiper up or down. Commonly found en-masse on sound boards. Variants 60MM - Slide Pot - X-Large (10k Linear Taper) <https://www.sparkfun.com/products/9119> (COM-09119) 10k linear slide pot with 60mm travel. Datasheet <http://cdn.sparkfun.com/datasheets/Components/Switches/SC608N-b10k.pdf> 30MM, 30MM-KIT - Slide Pot - Medium (10k Linear Taper) <https://www.sparkfun.com/products/11621> (COM-11621) 10k linear slide pot with 30mm travel. Datasheet <http://cdn.sparkfun.com/datasheets/Components/Switches/C-31-.pdf> (C3031N-1A2-B10K-GP) "KIT" variant, intended for soldering kits, has tStop removed from pads so the component can only be stuffed on one side of the board. 20MM - Slide Pot - Small (10k Linear Taper) <https://www.sparkfun.com/products/11620> (COM-11620) 10k linear slide pot with 20mm travel. Datasheet <http://cdn.sparkfun.com/datasheets/Components/Switches/C-31-.pdf> (C2031N-1A2-B10K-GP); PROD_ID: RES-11924; SF_SKU: COM-11620
Y1 Y2 = SparkFun-Clocks:CRYSTAL-16MHZ: 16MHz Crystal Digikey Example <http://www.digikey.com/product-search/en?keywords=535-9122-1-ND> Frequency: 16MHz Frequency Stability: ±50ppm Frequency Tolerance: ±20ppm Load Capacitance: 18pF SparkFun Products: Pro Micro -5V/16MHz <https://www.sparkfun.com/products/12640> SparkFun Serial Enabled LCD Kit <https://www.sparkfun.com/products/10097>; PROD_ID: XTAL-14681